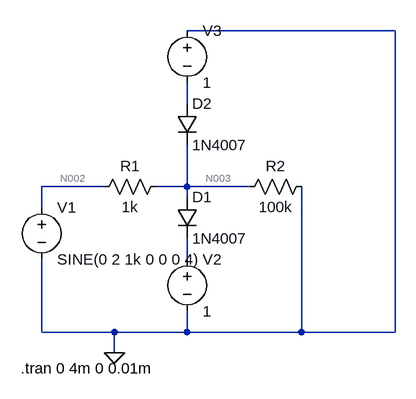
[diagram p0: schematic BIASED_CLIPPER.asc]
BIASED_CLIPPER.asc, the LTspice schematic file:
Version 4.1
SHEET 1 880 696
WIRE -112 160 -432 160
WIRE -432 272 -432 240
WIRE -560 400 -656 400
WIRE -432 400 -432 336
WIRE -432 400 -480 400
WIRE -336 400 -432 400
WIRE -432 416 -432 400
WIRE -656 432 -656 400
WIRE -432 512 -432 480
WIRE -656 624 -656 512
WIRE -544 624 -656 624
WIRE -432 624 -432 592
WIRE -432 624 -544 624
WIRE -256 624 -256 400
WIRE -256 624 -432 624
WIRE -112 624 -112 160
WIRE -112 624 -256 624
WIRE -544 656 -544 624
FLAG -544 656 0
SYMBOL res -464 384 R90
WINDOW 0 0 56 VBottom 2
WINDOW 3 32 56 VTop 2
SYMATTR InstName R1
SYMATTR Value 1k
SYMBOL voltage -656 416 R0
WINDOW 123 0 0 Left 0
WINDOW 39 0 0 Left 0
SYMATTR InstName V1
SYMATTR Value SINE(0 2 1k 0 0 0 4)
SYMBOL diode -448 416 R0
SYMATTR InstName D1
SYMATTR Value 1N4007
SYMBOL voltage -432 496 R0
SYMATTR InstName V2
SYMATTR Value 1
SYMBOL res -240 384 R90
WINDOW 0 0 56 VBottom 2
WINDOW 3 32 56 VTop 2
SYMATTR InstName R2
SYMATTR Value 100k
SYMBOL diode -448 272 R0
SYMATTR InstName D2
SYMATTR Value 1N4007
SYMBOL voltage -432 144 R0
SYMATTR InstName V3
SYMATTR Value 1
TEXT -688 680 Left 2 !.tran 0 4m 0 0.01m

The netlist it stands for:
* BIASED_CLIPPER.asc
R1 N003 N002 1k
V1 N002 0 SINE(0 2 1k 0 0 0 4)
D1 N003 N004 1N4007
V2 N004 0 1
R2 0 N003 100k
D2 N001 N003 1N4007
V3 0 N001 1
.model D D
.lib standard.dio
.tran 0 4m 0 0.01m
.backanno
.end

* Results of the author's LTspice run, read from the files saved beside the schematic
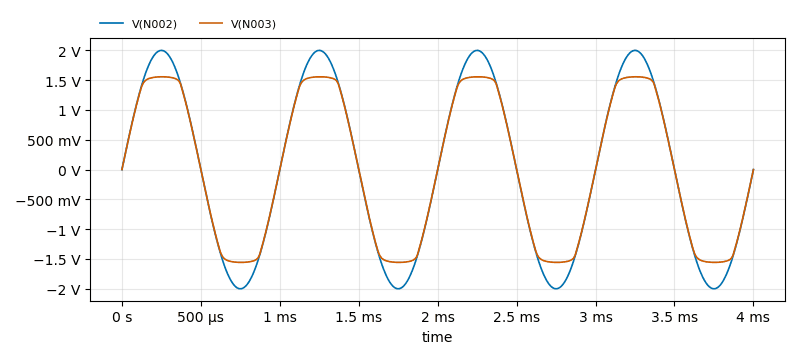
[diagram p1: Transient Analysis of BIASED_CLIPPER.asc, plotted from the saved traces]
* Transient Analysis, 1 run:
*   V(N002): min -2 V, max 2 V, average 293.6 nV, rms 1.414 V, last 0 V
*   V(N003): min -1.557 V, max 1.557 V, average 1.557 µV, rms 1.234 V, last -493.5 µV